# EAGLE design Mini-Lora-Grove (EAGLE 7.7.0)
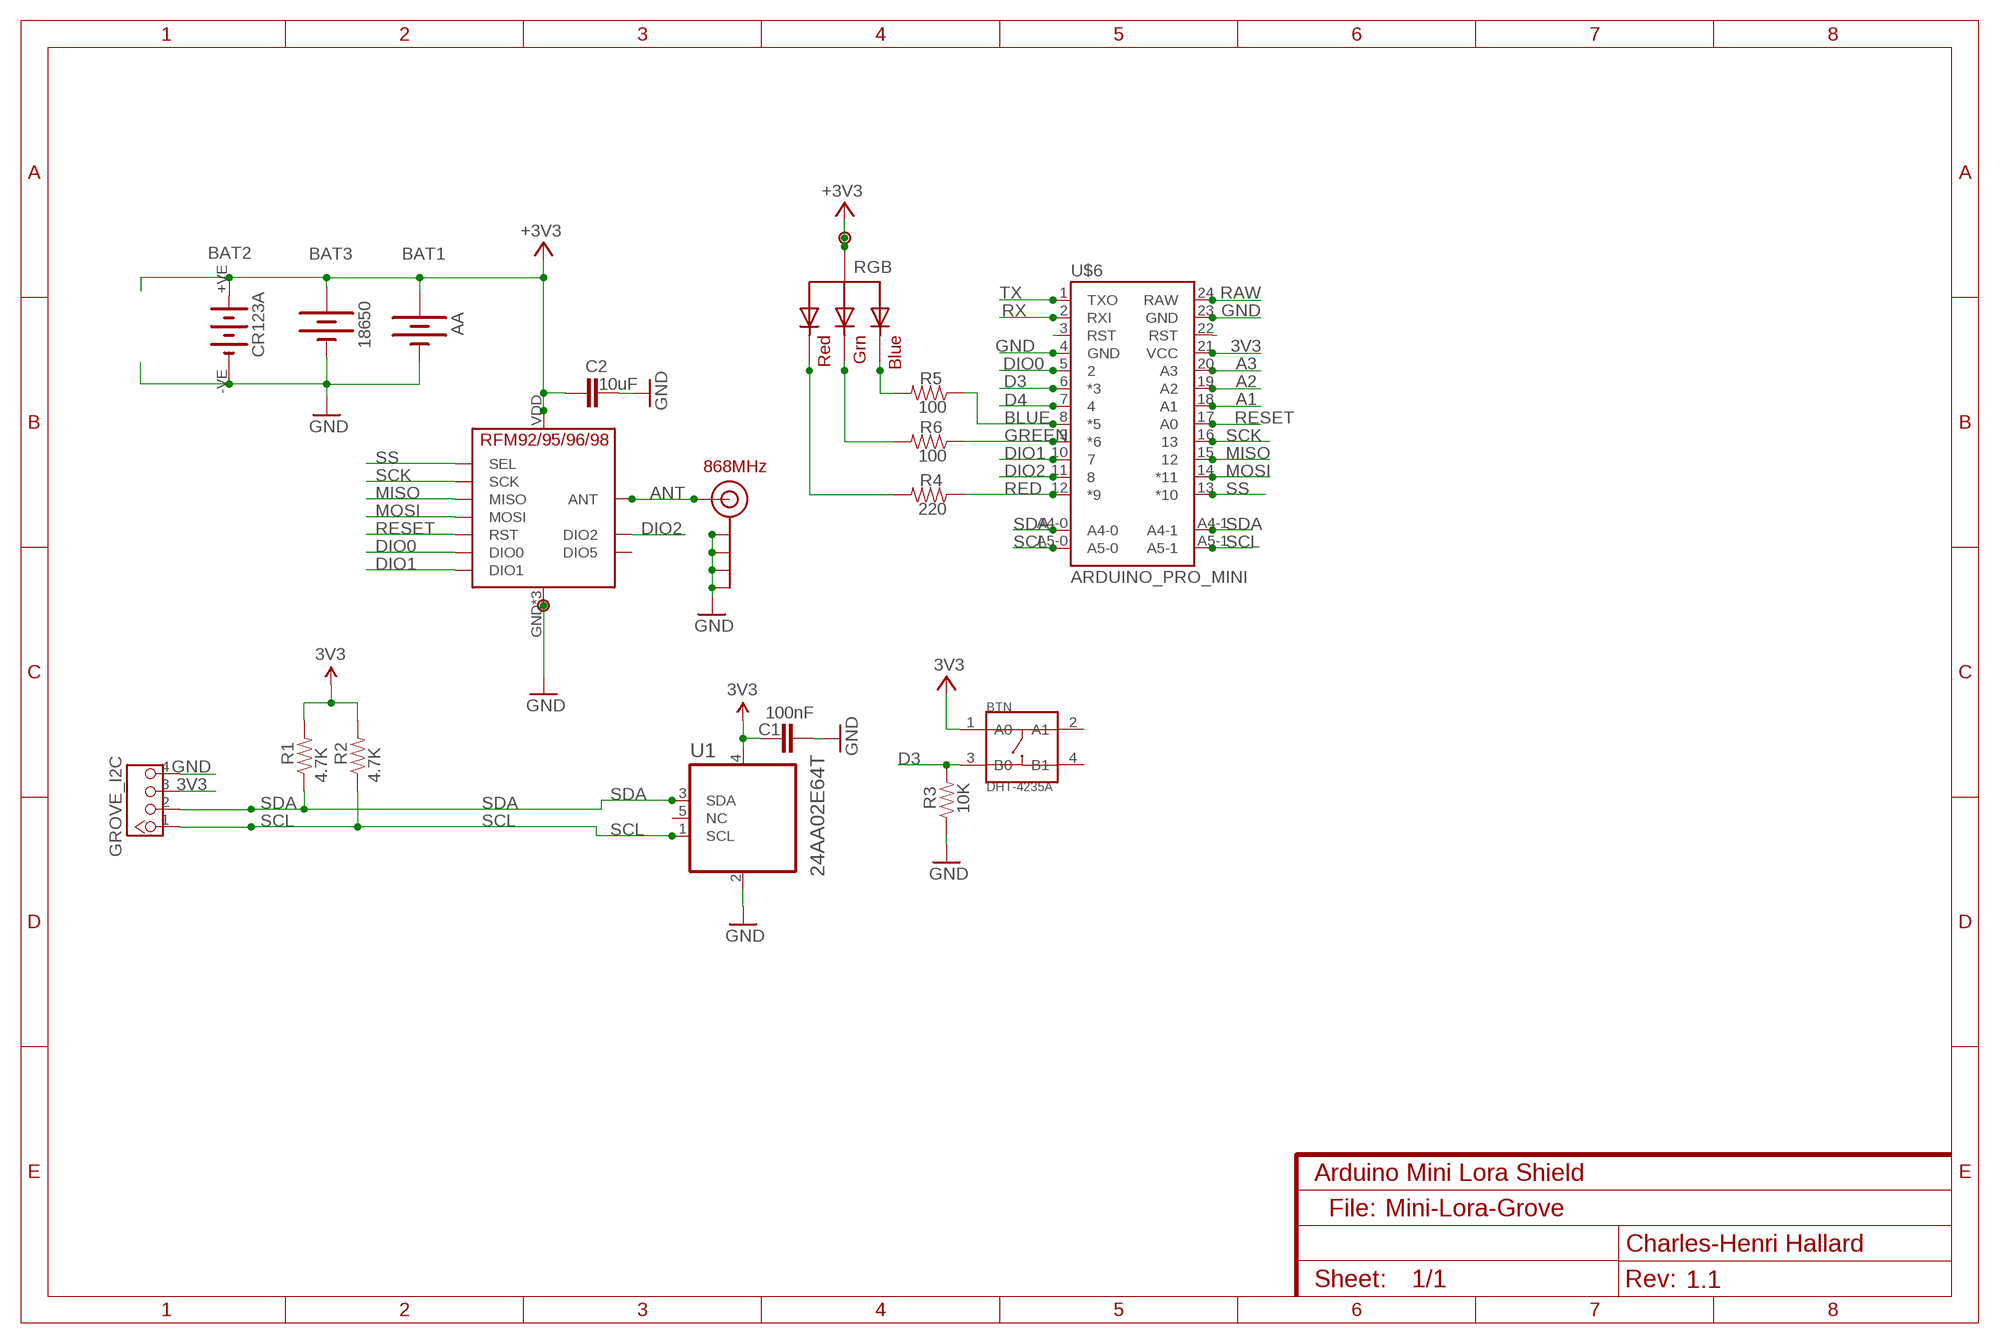
[diagram p0: schematic, sheet 1]
NAME (FRAME-A4L): CNAME: Arduino Mini Lora Shield; CREVISION: 1.1; DESIGNER: Charles-Henri Hallard

## Parts
BAT1  AA  BATTERYAA  [BATTERY-AA]
BAT2  CR123A  BATT-CR123A  [KEYSTONE-2/3A]
BAT3  18650  BATTERY18650  [BATTERY_18650-HOLDER]
BTN  DHT-4235A  SMD-BUTTON-TOP-DHT-4235A(4P-4.2X3.2MM)  [SW4-SMD-4.2X3.2X2.5MM]
C1  100nF  CAP0805-CAP  [0805-CAP]
C2  10uF  CAP0805-CAP-LARGEPADS  [0805-CAP-LARGEPADS]
GROVE_I2C  4P-2.0  GROVE-CONNECTOR-DIP(4P-2.0)  [HW4-2.0]
J$2  ANTENNATINY  [SMA_UFL_PAD_TINY]
P1  GND  PADNORMAL  [PAD]
P4  PADNORMAL  [PAD]
R1  4.7K  RESISTOR0805-RES  [0805-RES]
R2  4.7K  RESISTOR0805-RES  [0805-RES]
R3  10K  RESISTOR0805-RES  [0805-RES]
R4  220  RESISTOR0805-RES  [0805-RES]
R5  100  RESISTOR0805-RES  [0805-RES]
R6  100  RESISTOR0805-RES  [0805-RES]
RGB  RGBLED  RGBLED_CASTRAIGHT  [LED5MMRGB_ST]
U1  24AA02E64T  24AA02E64T-I/OT  [SOT95P270X145-5N]
U$5  RFM95  [RFM95]
U$6  ARDUINO_PRO_MINI  [ARDUINO_PRO_MINI]

## Nets
3V3: BAT1.PWR@1(+) BAT2.+VE(+) BAT3.PWR@1(+) BTN.1(A0) C1.1 C2.2 GROVE_I2C.3 P4.1 R1.2 R2.2 RGB.2(VCC) U1.4(VCC) U$5.VDD(VCC) U$6.21(VCC) ; supply symbol labelled +3V3
A1: U$6.18(A1)
A2: U$6.19(A2)
A3: U$6.20(A3)
ANT: J$2.ANT1(SIGNAL) J$2.ANT2(SIGNAL) J$2.ANT3(SIGNAL) U$5.ANT
BLUE: R5.1 U$6.8(*5)
D3: BTN.3(B0) R3.2 U$6.6(*3)
D4: U$6.7
DIO0: U$5.DIO0 U$6.5
DIO1: U$5.DIO1 U$6.10
DIO2: U$5.DIO2 U$6.11
GND: BAT1.GND@1(-) BAT2.-VE(-) BAT3.GND@1(-) C1.2 C2.1 GROVE_I2C.4 J$2.GND1(GND) J$2.GND2(GND) J$2.GND3(GND) J$2.GND4(GND) P1.1 R3.1 U1.2(VSS) U$5.GND U$5.GND1(GND) U$5.GND2(GND) U$6.4(GND) U$6.23(GND)
GREEN: R6.1 U$6.9(*6)
LB: R5.2 RGB.4(BLUE)
LG: R6.2 RGB.3(GREEN)
LR: R4.2 RGB.1(RED)
MISO: U$5.MISO U$6.15
MOSI: U$5.MOSI U$6.14(*11)
N$3: U$6.3(RST)
RAW: U$6.24(RAW)
RED: R4.1 U$6.12(*9)
RESET: U$5.RST U$6.17(A0)
RST: U$6.22(RST)
RX: U$6.2(RXI)
SCK: U$5.SCK U$6.16
SCL: GROVE_I2C.1 R2.1 U1.1(SCL) U$6.A5-0 U$6.A5-1
SDA: GROVE_I2C.2 R1.1 U1.3(SDA) U$6.A4-0 U$6.A4-1
SS: U$5.NSS(SEL) U$6.13(*10)
TX: U$6.1(TXO)
Unconnected: BTN.2(A1) BTN.4(B1) U1.5(NC) U$5.DIO5

## Notes on the sheet
- 868MHz
- File:

## Library data of the parts
BAT1 = JeeLabs.rpt:BATTERY: Battery Holders
BAT2 = edeca.net-v5:BATT-CR123A: CR123A (2/3rd AA) battery holder Manufacturer: Keystone Mouser part: 534-1019
BAT3 = _c2h:BATTERY: Battery Holders
BTN = Switch-2016:SMD-BUTTON-TOP-DHT-4235A(4P-4.2X3.2MM): 311020045; MPN: DHT-4235A
C1 C2 = _c2h:CAP: Capacitor Standard 0603 ceramic capacitor, and 0.1" leaded capacitor.
GROVE_I2C = Connector -2016:GROVE-CONNECTOR-DIP(4P-2.0): 320110033
J$2 = _c2h:ANTENNA: SMA Antenna Connector End launch SMA connector. The paste layer has been removed so that the connector can be hand soldered onto the board after reflow.
P1 P4 = _c2h:PAD
R1-R6 = _c2h:RESISTOR: Resistor Basic schematic elements and footprints for 0603, 1206, and PTH resistors.
RGB = _c2h:RGBLED_CA: RGB LED, common-anode 5MM Staggered pins 5mm Piranha package http://www.ladyada.net/library/pcb/eaglelibrary.html
U1 = Microchip-24AA02E64T:24AA02E64T-I/OT: 2K I2C™ Serial EEPROMs, SOT23-5; MPN: 24AA02E64T-I/OT; OC_FARNELL: 2345567; OC_NEWARK: 01X0461; PACKAGE: SOT23-5; SUPPLIER: Microchip
U$5 = _c2h:RFM95
U$6 = _c2h:ARDUINO_PRO_MINI

## Net classes
0 default: width 0.203 mm, drill 0.356 mm, clearance 0.152 mm
1 power: width 0.203 mm, clearance 0.152 mm
2 GND: width 0.203 mm, drill 0.305 mm, clearance 0.152 mm

## Board
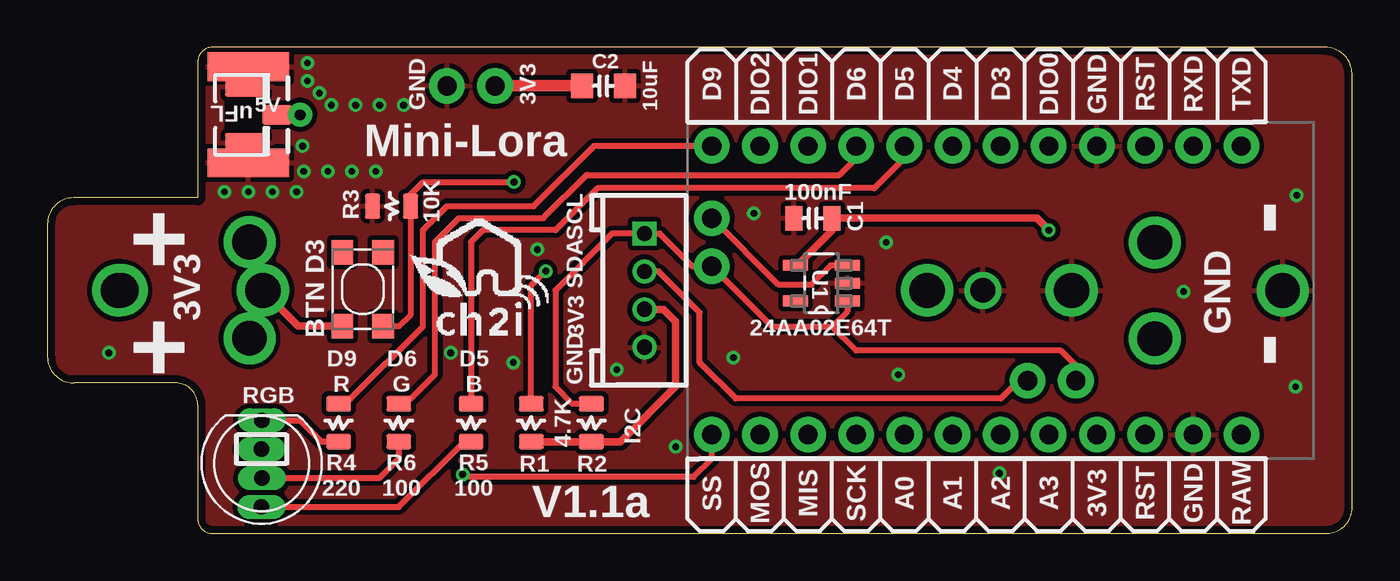
[diagram p1: board, top side]
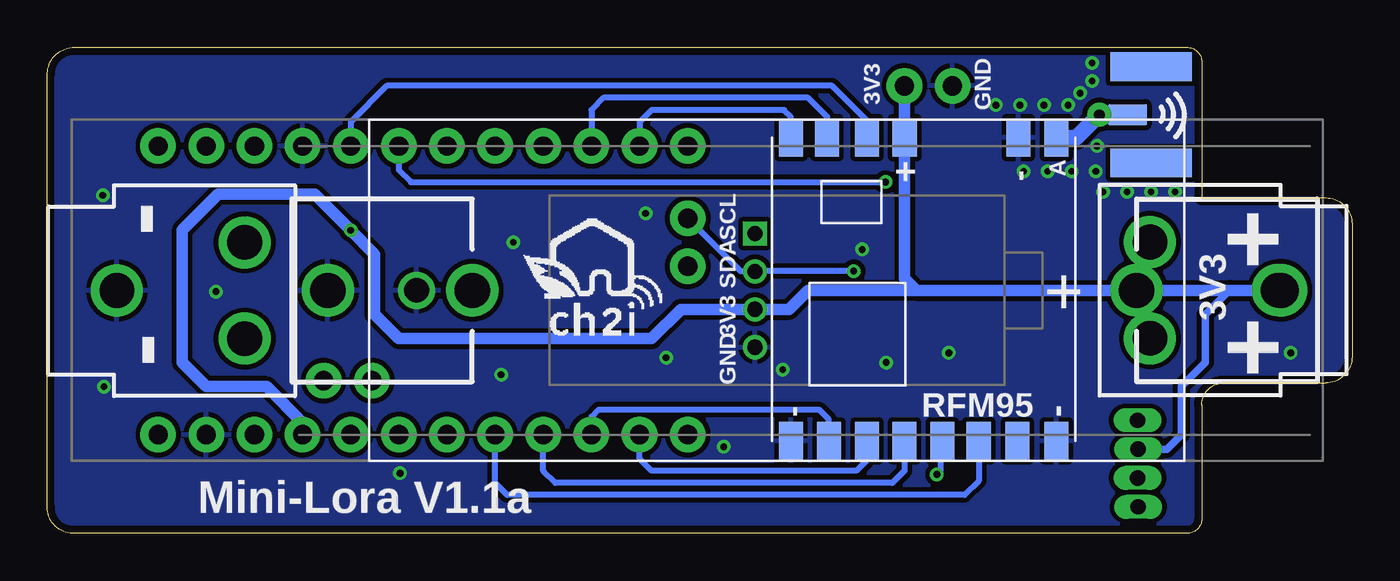
[diagram p2: board, bottom side, seen from below]

Size 68.83 x 25.65 mm. Coordinates in mm from the lower left corner, seen from the top.
Outline: 8.7,25.65 67.41,25.65 arc-90 68.83,24.26 68.83,1.4 arc-90 67.5,0 8.7,0 arc-90 7.94,0.76 7.94,6.79 arc90 6.73,7.94 1.4,7.94 arc-90 0,9.33 0,16.32 arc-90 1.4,17.72 7.94,17.72 7.94,24.89 arc-90 8.7,25.65
Outline: 8.7,25.65 8.67,25.65
Copper layers (1*16): Top 0.0356mm / dielectric 1.5011mm / Bottom 0.0356mm
Design rules "PCBs_io": minimum track width 6mil, minimum drill 13mil, track to track 6mil, track to pad 6mil, pad to pad 6mil, via to via 6mil, smd to smd 6mil, copper to edge 15mil, drill to drill 6mil, minimum pad ring 7mil, minimum via ring 7mil, stop-mask expansion 3mil, vias tented up to drill 40mil, thermal gap 10mil

### Footprints (pad centres in the part's own frame; a part is rotated, then mirrored left to right if it is on the bottom)
BATTERY-AA = drill 1.854: GND@1 25.146,0; GND@2 17.526,0; PWR@1 -25.146,0; PWR@2 -17.526,0
KEYSTONE-2/3A = drill 1.3: +VE 0,19; -VE 0,-19
BATTERY_18650-HOLDER = drill 1.829: GND@1 30.628,0.01; GND@2 23.88,2.55; GND@3 23.88,-2.53; PWR@1 -30.628,-0.01; PWR@2 -23.88,2.53; PWR@3 -23.88,-2.55
SW4-SMD-4.2X3.2X2.5MM = smd 1.3 x 1.15: 1 -1.95,1.075; 2 1.95,1.075; 3 -1.95,-1.075; 4 1.95,-1.075
0805-CAP = smd 0.902 x 1.3: 1 -1,0; 2 1,0
0805-CAP-LARGEPADS = smd 1.156 x 1.3: 1 -1.127,0; 2 1.127,0
HW4-2.0 = drill 0.8 pad 1.27 square: 1 -3,0 | drill 0.8 pad 1.27: 2 -1,0; 3 1,0; 4 3,0
SMA_UFL_PAD_TINY = smd 1.524 x 1.016: ANT1 -3.843,0 | drill 0.559 pad 1.27: ANT2 -5.08,0 | smd 2.032 x 1.143 bottom: ANT3 -3.589,0 | smd 2.2 x 1.016: GND1 -2.223,1.47; GND2 -2.223,-1.47 | smd 4.318 x 1.524: GND3 -2.349,-2.54; GND4 -2.349,2.54 | smd 4.318 x 1.524 bottom: GND5 -2.349,2.54; GND6 -2.349,-2.54
PAD = drill 1.016 pad 1.88: 1 0,0
0805-RES = smd 0.8 x 1.3: 1 -1,0; 2 1,0
LED5MMRGB_ST = drill 0.8 pad 1.27 long: 1 -2.286,0.016; 2 -0.762,-0.016; 3 0.762,0.016; 4 2.286,-0.016
SOT95P270X145-5N = smd 1.321 x 0.559: 1 -1.372,0.94; 2 -1.372,0; 3 -1.372,-0.94; 4 1.372,-0.94; 5 1.372,0.94
RFM95 = smd 2 x 1.27: ANT 5.777,-7; DIO0 5.777,3; DIO1 5.779,5.095; DIO2 5.779,7; DIO5 -10.225,-4.936; GND 5.777,-5; GND1 -10.223,7; GND2 -10.23,-7; MISO -10.23,5; MOSI -10.225,3; NSS -10.223,-1; RST -10.223,-2.905; SCK -10.23,1.012; VDD 5.777,1
ARDUINO_PRO_MINI = drill 1.016 pad 1.88: 1 -7.62,12.7; 2 -7.62,10.16; 3 -7.62,7.62; 4 -7.62,5.08; 5 -7.62,2.54; 6 -7.62,0; 7 -7.62,-2.54; 8 -7.62,-5.08; 9 -7.62,-7.62; 10 -7.62,-10.16; 11 -7.62,-12.7; 12 -7.62,-15.24; 13 7.62,-15.24; 14 7.62,-12.7; 15 7.62,-10.16; 16 7.62,-7.62; 17 7.62,-5.08; 18 7.62,-2.54; 19 7.62,0; 20 7.62,2.54; 21 7.62,5.08; 22 7.62,7.62; 23 7.62,10.16; 24 7.62,12.7; A4-0 -3.81,-15.24; A4-1 4.763,1.429; A5-0 -1.27,-15.24; A5-1 4.763,3.969

### Placement (x,y rotation side)
BAT1  28.89,12.83 180 bottom
BAT2  30.35,12.83 270 bottom
BAT3  34.54,12.83 180 bottom
BTN  16.64,12.89 90 top
C1  40.39,16.64 180 top
C2  29.34,23.62 180 top
GROVE_I2C  31.5,12.83 270 top
J$2  8.25,22.1 180 top
P1  21.08,23.62 0 top
P4  23.62,23.62 0 top
R1  25.53,5.84 270 top
R2  28.7,5.84 270 top
R3  18.16,17.27 0 top
R4  15.37,5.84 270 top
R5  22.35,5.84 270 top
R6  18.54,5.84 270 top
RGB  11.3,3.68 270 top
U1  40.83,13.21 180 top
U$3  [LOGO_CH2I_75MM]  23.24,12.45 0 top
U$4  [LOGO_CH2I_75MM]  39.62,12.45 0 bottom
U$5  22.61,15.11 90 bottom
U$6  50.29,12.83 270 top

### Tracks (layer width: path | path; a pad name or v marks a point on that pad's centre or on a via)
3V3  (via drill 0.36 pad 0.71)
  Top 0.305: BAT1.PWR@1 3.78,12.83 BAT3.PWR@1
  Top 0.406: U1.4 39.5,14.19 39.59,14.19 41.39,15.99 C1.1 52.2,16.64 v52.83,16 | 25.51,4.83 R1.2 R2.2 30.24,4.84 33.15,7.75 33.15,11.19 32.51,11.83 GROVE_I2C.3 | BTN.1 13.24,10.94 BAT2.+VE
  Top 0.61: C2.2 P4.1
  Bottom 0.406: 55.37,5.52 U$6.21 | 6.48,12.83 7.75,11.56 7.75,9.02 9.02,7.75 9.02,5.21 9.78,4.44 RGB.2
  Bottom 0.61: P4.1 23.61,23.61 U$5.VDD 23.61,13.45 22.99,12.83 | 55.37,5.52 55.37,5.84 57.28,7.75 60.45,7.75 61.72,9.02 61.72,16 59.82,17.91 54.74,17.91 v52.83,16 51.56,14.73 51.56,11.56 50.29,10.29 36.96,10.29 35.42,11.83 GROVE_I2C.3 29.7,11.83 28.7,12.83 22.99,12.83 | 22.99,12.83 BAT2.+VE 6.48,12.83 3.8,12.83 BAT3.PWR@1
ANT
  Top 0.61: J$2.ANT1 J$2.ANT2
  Bottom 0.61: J$2.ANT3 J$2.ANT2
  Bottom 0.813: U$5.ANT 14.54,20.89 J$2.ANT2
BLUE
  Top 0.305: U$6.8 45.21,19.81 43.62,18.22 29.02,18.22 26.8,16 22.99,16 22.35,15.37 R5.1 22.72,6.84
D3  (via drill 0.36 pad 0.71)
  Top 0.305: v24.62,18.54 23.22,18.54 19.81,18.54 19.16,17.89 R3.2 19.16,11.54 18.54,10.92 17.73,10.92 BTN.3
  Bottom 0.305: U$6.6 50.29,19.18 49.66,18.54 29.82,18.54 v24.62,18.54
DIO0
  Bottom 0.305: U$5.DIO0 25.61,21.8 27.43,23.62 50.93,23.62 52.83,21.72 U$6.5
DIO1
  Bottom 0.305: U$5.DIO1 27.7,21.99 28.7,22.99 39.5,22.99 40.13,22.35 U$6.10
DIO2
  Bottom 0.305: U$5.DIO2 29.61,21.99 29.97,22.35 36.96,22.35 37.59,21.72 U$6.11
GND  (via drill 0.36 pad 0.71)
  other vias: 3.24,9.53 33.15,4.57 44.26,15.37 44.89,8.38 65.91,17.84 65.85,7.75 24.57,9.02 30.04,8.64 59.94,12.76 50.23,3.17 25.84,14.99 16.26,22.61 14.99,22.61 14.35,23.24 13.72,23.88 13.72,24.83 13.46,20.45 10.6,18.03 11.87,18.03 13.14,18.03 9.33,18.03 13.53,19.11 17.53,22.61 18.8,22.61 14.8,19.11 16.07,19.11 17.34,19.11 21.27,9.53 36.2,9.27 37.27,16.89
  pour Bottom (isolate 0.254): 69.98,26.8 69.98,-1.14 -1.14,-1.14 -1.14,26.8
  pour Top (isolate 0.254): -0.51,26.16 69.34,26.16 69.34,-0.51 -0.51,-0.51
GREEN
  Top 0.305: U$6.9 42.67,19.81 41.78,18.92 28.45,18.92 26.16,16.64 21.72,16.64 20.45,15.37 20.45,8.38 19.18,7.11 R6.1
LB
  Top 0.305: R5.2 21.99,4.84 18.54,1.4 RGB.4
LG
  Top 0.305: R6.2 18.54,3.94 17.53,2.92 RGB.3
LR
  Top 0.305: RGB.1 13.34,5.97 14.46,4.84 R4.2
MISO
  Bottom 0.305: U$6.15 40.13,6.16 39.75,6.54 28.13,6.54 27.61,6.02 U$5.MISO
MOSI
  Bottom 0.305: U$5.MOSI 25.61,3.86 26.16,3.3 36.96,3.3 37.59,3.94 U$6.14
RED
  Top 0.305: U$6.12 28.83,20.45 25.65,17.27 21.08,17.27 19.81,16 19.81,10.92 16,7.11 R4.1
RESET
  Bottom 0.305: U$5.RST 19.7,2.78 20.45,2.03 44.58,2.03 45.21,2.67 U$6.17
SCK
  Bottom 0.305: U$5.SCK 23.62,3.31 24.26,2.67 42.04,2.67 42.67,3.3 U$6.16
SCL
  Top 0.305: U1.1 42.2,11.72 41.4,10.92 | 41.4,10.92 38.23,10.92 U$6.A5-0 34.04,14.1 32.31,15.83 GROVE_I2C.1 29.8,15.83 26.8,12.83 26.8,7.75 27.7,6.84 R2.1 | U$6.A5-1 54.26,8.86 53.47,9.65 42.67,9.65 41.4,10.92
SDA  (via drill 0.36 pad 0.71)
  Top 0.305: 42.15,14.1 U1.3 41.33,14.15 40.32,13.15 38.54,13.15 U$6.A4-0 | R1.1 25.53,13.08 v26.29,13.84 | U$6.A4-1 51.24,8.06 50.29,7.11 36.32,7.11 34.42,9.02 34.42,11.65 32.24,13.83 GROVE_I2C.2
  Bottom 0.305: v26.29,13.84 31.48,13.84 GROVE_I2C.2 32.24,13.83 U$6.A4-0
SS  (via drill 0.36 pad 0.71)
  Top 0.305: U$6.13 35.05,3.94 34.1,2.98 22.04,2.98 v21.91,3.11
  Bottom 0.305: U$5.NSS 21.72,5 21.72,3.3 v21.91,3.11

### Text on the board
tNames: GND | 3V3 | D9 | DIO2 | DIO1 | D6 | D5 | D4 | D3 | DIO0 | GND | RST | RXD | TXD | 5V | Mini-Lora | - | + | SCL | 3V3 | BTN D3 | SDA | GND | + | 3V3 | - | D9 / R | D6 / G | D5 / B | GND | I2C | V1.1a | SS | MOS | MIS | SCK | A0 | A1 | A2 | A3 | 3V3 | RST | GND | RAW
bNames: GND | 3V3 | - | + | SCL | 3V3 | SDA | + | 3V3 | - | GND | RFM95 | Mini-Lora V1.1a